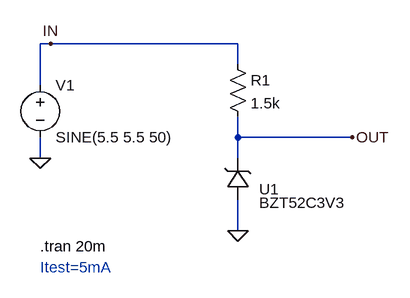
[diagram p0: schematic BZT52C3V3.asc]
BZT52C3V3.asc, the LTspice schematic file:
Version 4.1
SHEET 1 880 680
WIRE -32 32 -48 32
WIRE 256 32 -32 32
WIRE 256 64 256 32
WIRE -48 96 -48 32
WIRE 256 176 256 144
WIRE 432 176 256 176
WIRE -48 208 -48 176
WIRE 256 208 256 176
WIRE 256 320 256 272
FLAG -48 208 0
FLAG 256 320 0
FLAG 432 176 OUT
FLAG -32 32 IN
SYMBOL voltage -48 80 R0
WINDOW 123 0 0 Left 0
WINDOW 39 0 0 Left 0
SYMATTR InstName V1
SYMATTR Value SINE(5.5 5.5 50)
SYMBOL res 240 48 R0
SYMATTR InstName R1
SYMATTR Value 1.5k
SYMBOL MyLib\\Diode_Zener\\BZT52C3V3 240 272 M180
WINDOW 38 49 -5 Left 2
SYMATTR InstName U1
TEXT -48 344 Left 2 !.tran 20m
TEXT -48 376 Left 2 ;Itest=5mA

The netlist it stands for:
* BZT52C3V3.asc
V1 IN 0 SINE(5.5 5.5 50)
R1 IN OUT 1.5k
X§U1 0 OUT BZT52C3V3  ; pins + -
.tran 20m
* Itest=5mA
.lib MyLib/Diode_Zener/BZT52C3V3.lib
.backanno
.end